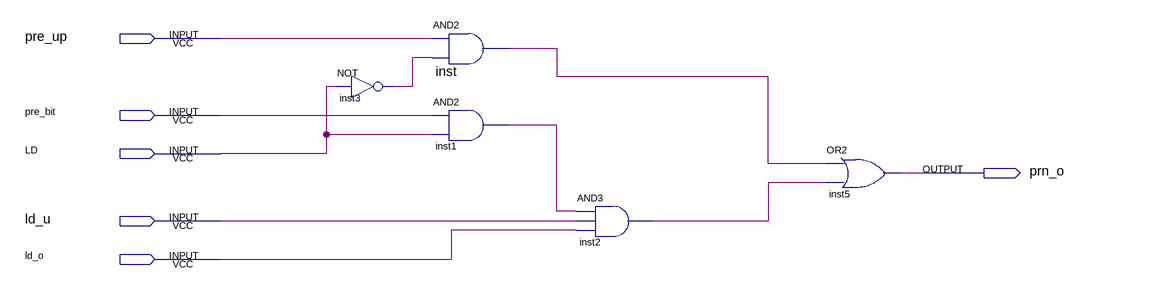
[diagram p0: schematic sheet]
// Quartus schematic preup_mux.bdf as structural Verilog: 5 symbols, 6 pins
module preup_mux (
  input  pre_up,
  input  pre_bit,
  input  LD,
  input  ld_u,
  input  ld_o,
  output prn_o
);

  wire inst1_out, inst2_out, inst3_out, inst_out;

  not inst3 (inst3_out, LD);
  and inst (inst_out, pre_up, inst3_out);
  and inst1 (inst1_out, pre_bit, LD);
  and inst2 (inst2_out, inst1_out, ld_u, ld_o);
  or inst5 (prn_o, inst_out, inst2_out);
endmodule
